# Altium project EE3102_Project.PrjPcb
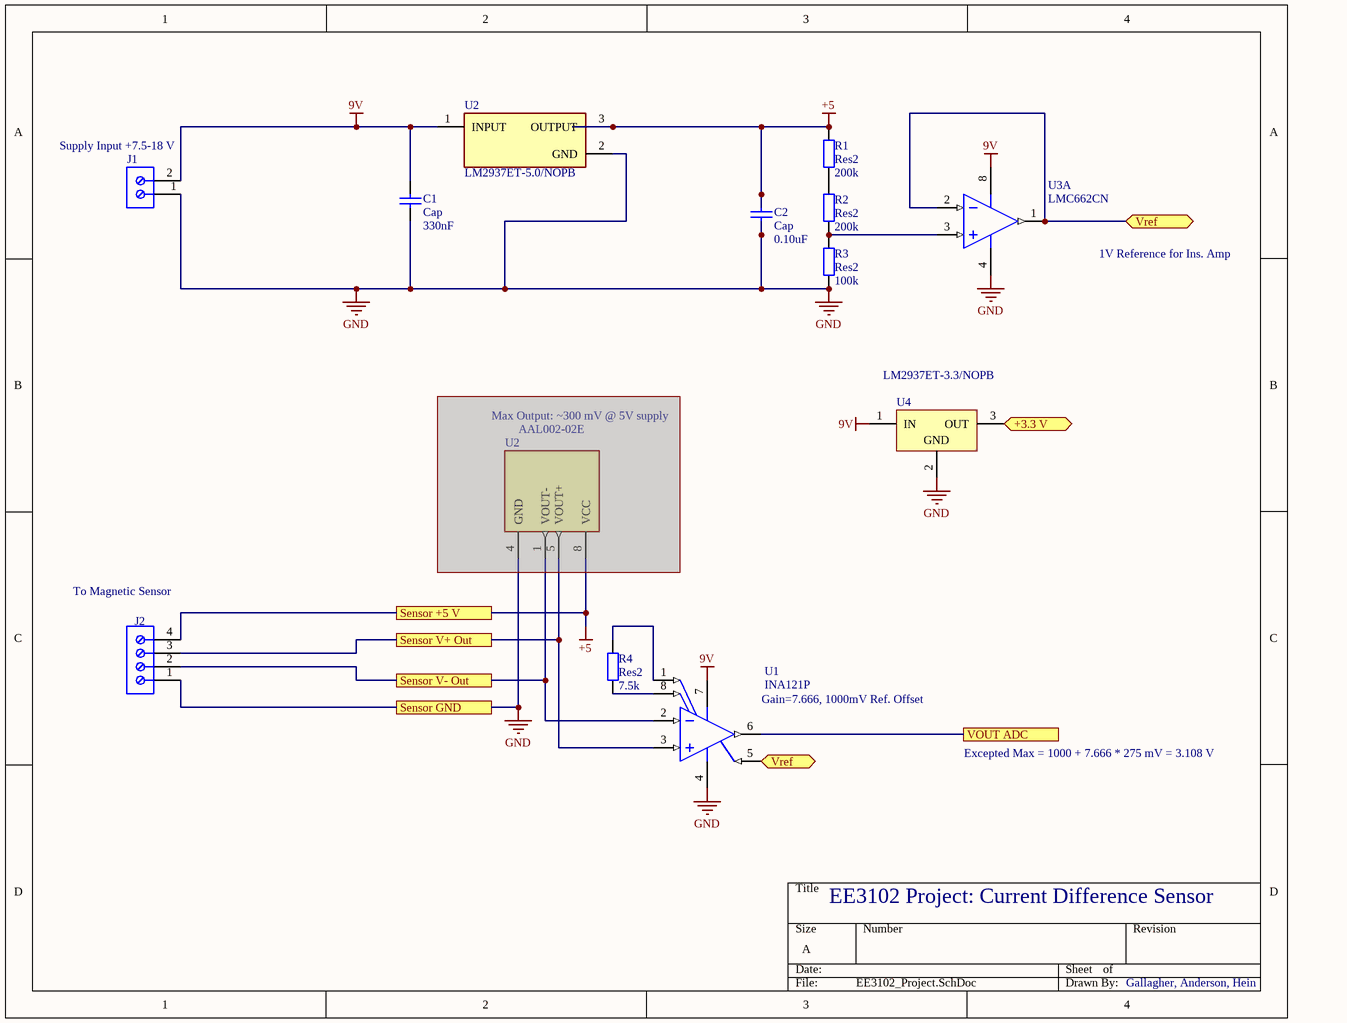
[diagram p0: EE3102_Project.SchDoc]
2 sheets, 21 parts. Net scope: flat (ports and power ports of the same name join across sheets).
Board file: EE3102_Project.PcbDoc
Sheets:
  EE3102_Project.SchDoc
  EE3102_Project_2.SchDoc

## Sheet EE3102_Project.SchDoc
size A; SheetNumber: 1; SheetTotal: 2

### Parts
(Parts that share a designator on the sheet are numbered #1, #2 ... from top to bottom, then left to right.)
C1  Cap  value 330nF  [RAD-0.3]
C2  Cap  value 0.10uF  [RAD-0.3]
J1  691137710002  [691137710002]  (value not drawn)
J2  691210910004  [691210910004]  (value not drawn)
R1  Res2  value 200k  [AXIAL-0.4]
R2  Res2  value 200k  [AXIAL-0.4]
R3  Res2  value 100k  [AXIAL-0.4]
R4  Res2  value 7.5k  [AXIAL-0.4]
U1  INA121P  [P0008A]
U2#1  LM2937ET-5.0/NOPB  [FP-NDE0003B-MFG]
U2#2  AAL002-02E  [Sensor_Socket_8]  (masked out: inside a compile mask, not in the netlist)
U3  LMC662CN  [N08E]  (part A of 2)
U4  LM2937ET-3.3/NOPB  [NDE0003A]

### Ports
+3.3 V (bidir), Sensor +5 V, Sensor GND, Sensor V+ Out, Sensor V- Out, VOUT ADC, Vref (bidir)

### Nets
9V: C1.2 J1.2(GND) U1.7(V+) U2#1.1(INPUT) U3.8(V+) U4.1(IN)
+5: C2.2 J2.4 R1.2 U2#1.3(OUTPUT) ; port Sensor +5 V
GND: C1.1 C2.1 J1.1(+7.5V_-_35V) J2.1 R3.1 U1.4(V-) U2#1.2(GND) U3.4(V-) U4.2(GND) ; port Sensor GND
NetC4_1: U4.3(OUT) ; port +3.3 V
NetJ2_2: J2.2 U1.2(VIN-) ; port Sensor V- Out
NetJ2_3: J2.3 U1.3(VIN+) ; port Sensor V+ Out
NetR1_1: R1.1 R2.2
NetR2_1: R2.1 R3.2 U3.3(INA+)
NetR4_1: R4.1 U1.8(RG)
NetR4_2: R4.2 U1.1(RG)
NetU1_5: U1.5(REF) U3.1(OUTA) U3.2(INA-) ; port Vref
NetU1_6: U1.6(VO) ; port VOUT ADC

### Notes on the sheet
- (near J1) Supply Input +7.5-18 V
- 1V Reference for Ins. Amp
- Max Output: ~300 mV @ 5V supply
- (near J2) To Magnetic Sensor
- (near U1) Gain=7.666, 1000mV Ref. Offset
- Excepted Max = 1000 + 7.666 * 275 mV = 3.108 V
- EE3102 Project: Current Difference Sensor
- Gallagher, Anderson, Hein

### Library data of the parts
C1 C2 = Cap: Capacitor; Published: 8-Jun-2000; LatestRevisionDate: 17-Jul-2002; LatestRevisionNote: Re-released for DXP Platform.; PackageReference: RAD-0.3; Publisher: Altium Limited; PackageDescription: Radial Cap, Thru-Hole; 2 Leads; 0.3 in Pin Spacing
J1 = CMP-1502-03324-1: Series 1377 - 5.00 mm Horizontal Entry with Pressure Clamp WR-TBL, 2 pin; Manufacturer: Wurth Elektronik; Pin Number: 2; Pitch: 5.00mm; Operating Temperature: -30to120degC; Package Reference: 691137710002; Publisher: WurthElektronik; Mounting Technology: THT; Manufacturer URL: http://www.we-online.de; Packaging: Box; Part Number: 691137710002; Datasheet URL: http://katalog.we-online.de/pbs/datasheet/691137710002.pdf
J2 = CMP-1502-02458-1: Serie 2109 - 2.54 mm Horizontal Entry with Rising Cage Clamp WR-TBL, 4 pin; Manufacturer: Wurth Elektronik; Pin Number: 4; Pitch: 2.54mm; Mounting Technology: THT; Datasheet URL: http://katalog.we-online.de/em/datasheet/6912109100xx.pdf; Manufacturer URL: http://www.we-online.de; Operating Temperature: -40to105degC; Publisher: WurthElektronik; Package Reference: 691210910004; Part Number: 691210910004; Packaging: Box
R1-R4 = Res2: Resistor; Published: 8-Jun-2000; LatestRevisionDate: 17-Jul-2002; LatestRevisionNote: Re-released for DXP Platform.; PackageReference: AXIAL-0.4; Publisher: Altium Limited; PackageDescription: Axial Device, Thru-Hole; 2 Leads; 0.4 in Pin Spacing
U1 = CMP-0992-00127-2: FET-Input, Low Power Instrumentation Amplifier, -40 to 85 degC, 8-pin DIP (P8), Green (RoHS & no Sb/Br); Manufacturer: Texas Instruments; Input Bias Current (+/-)(Max)(nA): 0.05; SubFamily: Dual Supply; Input Offset Drift (+/-)(Max)(uV/Degrees Celsius): 5; Input Offset (+/-)(Max)(uV): 500; Quiescent Current (+/-)(Typ)(mA): 0.45; Non-Linearity (+/-)(Max)(%): 0.005; Number of Channels: 1; Noise at 1kHz(Typ)(nV/rt(Hz)): 20; CMRR(Min)(dB): 96; Output Offset Drift (+/-)(Max)(uV/Degrees Celsius): 20/G; Vs(Min)(V): 4.5; Gain(V/V): 1 to 10000; Output Offset (+/-)(Max)(uV): 500/G; Vs(Max)(V): 36; ComponentLink3URL: http://www.ti.com/litv/pdf/mpdi001b; ComponentLink3Description: Package Specification; Mounting Technology: Through Hole; ComponentLink2Description: Datasheet; PackageReference: P0008A; Code_JEDEC: MS-001; Eco-Plan: Green (RoHS & no Sb/Br); ComponentLink1URL: http://www.ti.com/; ComponentLink2URL: http://www.ti.com/general/docs/lit/getliterature.tsp?genericPartNumber=INA121&fileType=pdf; PartNumber: INA121P; ComponentLink1Description: Manufacturer URL; PackageDescription: 8-Pin Plastic In-Line, Body 9.59 x 6.35 mm, Pitch 2.54 mm; DatasheetVersion: SBOS078; PackageVersion: 4040082/E, 04/2010
U2#1 = CMP-0062-02519-4: IC REG LINEAR 5V 500MA TO220-3; Manufacturer: Texas Instruments; Standoff Height: 3.3mm; Max Supply Voltage: 26V; Min Supply Voltage: 6V; Max Junction Temp: +125°C; Number Of Outputs: 1; Accuracy Percentage: 5%; Dropout Voltage: 0.5V; Output Type: Fixed; Nominal Supply Current: 2-10mA; Output Voltage: 5V; Digikey Description: IC REG LINEAR 5V 500MA TO220-3; Temperature: -40°C to +125°C; Category: IC; Temperature Range High: +125°C; ComponentLink2Description: Datasheet; Package: NDE0003B; Manufacturer Part Number: LM2937ET-5.0/NOPB; ComponentLink2URL: http://www.ti.com/lit/ds/symlink/lm2937.pdf; Ipc Land Pattern Name: TO-220; Height: 19.55mm; Device Class L3: Voltage Regulators - Linear; Automotive: No; Octopart: https://octopart.com/lm2937et-5.0%2Fnopb-texas+instruments-24813532; Device Class L1: Integrated Circuits (ICs); Output Current: 500mA; RoHS: TRUE; Temperature Range Low: -40°C; Lead Free: Yes; Device Class L2: Power Management ICs
U2#2 = AAL002-02E: 1.5 mT Sat. Analog Sensor, 5.5 KOhm, RoHS SOIC; MF: NVE; Package: SOIC-8 NVE; SnapEDA_Link: https://www.snapeda.com/parts/AAL002-02E/NVE/view-part/75689/?ref=snap; Value: *; Price: None; MP: AAL002-02E; Availability: Unavailable
U3 = CMP-0055-00172-2: CMOS Dual Operational Amplifier, 8-pin MDIP; Manufacturer: National Semiconductor; PowerWise: N; CompType: Amplifiers; PackageTopMarking: NSUZXYTTE#*LMC*662CN; ComponentLink3Description: N08E Package Page; RoHS: N; ComponentLink3URL: http://www.national.com/packaging/folders/n08e.html; PackageReference: N08E; ComponentLink1URL: http://www.national.com/ds/LM/LMC662.pdf; ComponentLink2Description: LMC662 Web Page; DatasheetVersion: Apr-2003; ComponentLink2URL: http://www.national.com/pf/LM/LMC662.html; PinCount: 8; PackageDescription: MDIP, .365 x .250 x .130in, 8 Lead, .100in Pitch; Code_JEDEC: MS-001-BA; RevisionNote: Component URLs added; ComponentLink1Description: LMC662 Datasheet; PackageVersion: revG, May-2006
U4 = CMP-0062-02520-3: 400mA and 500mA Voltage Regulator, 3-pin TO-220, Pb-Free; Manufacturer: Texas Instruments; CompType: LDO IC; PackageTopMarking: NSUZXYTTE#*LM2937ET*-3.3; PowerWise: N; RoHS: Y; PinCount: 3; PackageDescription: TO-220, Molded, 3 Lead, Straight; ComponentLink1Description: Datasheet URL; ComponentLink1URL: http://www.ti.com/general/docs/lit/getliterature.tsp?genericPartNumber=LM2937-3.3&fileType=pdf; PackageReference: NDE0003A

## Sheet EE3102_Project_2.SchDoc
size A; SheetNumber: 2; SheetTotal: 2
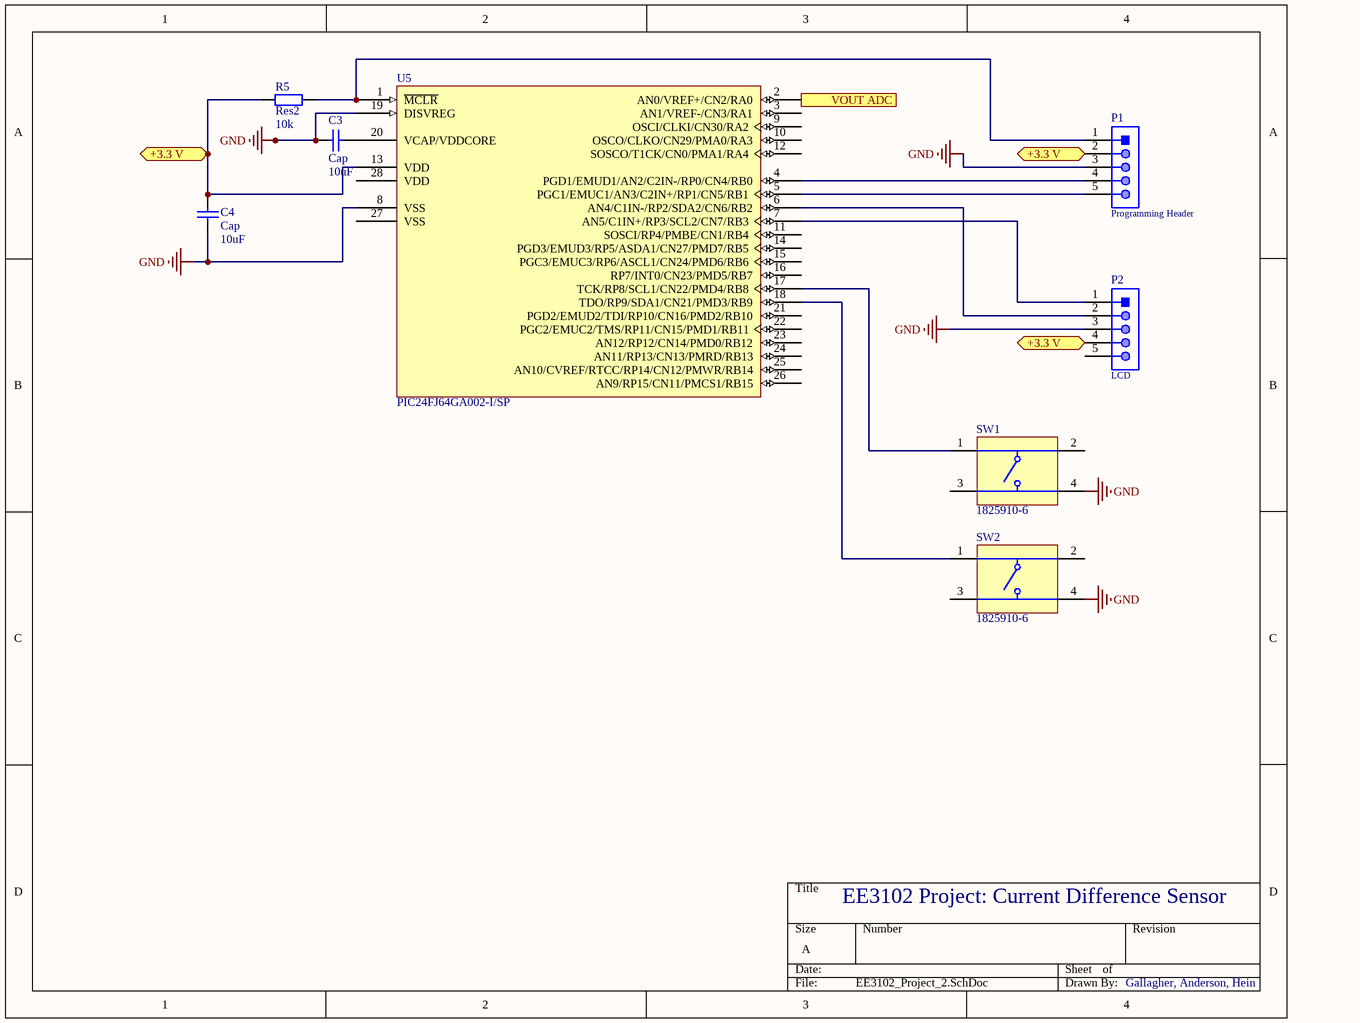
[diagram p1: EE3102_Project_2.SchDoc]

### Parts
C3  Cap  value 10uF  [RAD-0.3]
C4  Cap  value 10uF  [RAD-0.3]
P1  Programming Header  [61300511121]
P2  LCD  [LCD_5_Pin]
R5  Res2  value 10k  [AXIAL-0.4]
SW1  1825910-6  [TECO-1825910-6_V]
SW2  1825910-6  [TECO-1825910-6_V]
U5  PIC24FJ64GA002-I/SP  [SPDIP300-SP28]

### Ports
+3.3 V (bidir), VOUT ADC

### Nets
GND: C3.2 C4.2 P1.3(VSS) P2.3(GND) SW1.4 SW2.4 U5.8(VSS) U5.19(DISVREG)
NetC3_1: C3.1 U5.20(VCAP/VDDCORE)
NetC4_1: C4.1 P1.2(VDD) P2.4(SDA) R5.2 U5.13(VDD) ; port +3.3 V
NetP1_1: P1.1(nmclr) R5.1 U5.1(~{MCLR})
NetP1_4: P1.4(PGD) U5.4(PGD1/EMUD1/AN2/C2IN-/RP0/CN4/RB0)
NetP1_5: P1.5(PGC) U5.5(PGC1/EMUC1/AN3/C2IN+/RP1/CN5/RB1)
NetP2_1: P2.1(XRST) U5.7(AN5/C1IN+/RP3/SCL2/CN7/RB3)
NetP2_2: P2.2(VDD) U5.6(AN4/C1IN-/RP2/SDA2/CN6/RB2)
NetSW1_1: SW1.1 U5.17(TCK/RP8/SCL1/CN22/PMD4/RB8)
NetSW2_1: SW2.1 U5.18(TDO/RP9/SDA1/CN21/PMD3/RB9)
NetU1_6: U5.2(AN0/VREF+/CN2/RA0) ; port VOUT ADC

Not connected (* = marked no-connect by the designer): P2 5(SCL); SW1 2 3; SW2 2 3; U5 3(AN1/VREF-/CN3/RA1) 9(OSCI/CLKI/CN30/RA2) 10(OSCO/CLKO/CN29/PMA0/RA3) 11(SOSCI/RP4/PMBE/CN1/RB4) 12(SOSCO/T1CK/CN0/PMA1/RA4) 14(PGD3/EMUD3/RP5/ASDA1/CN27/PMD7/RB5) 15(PGC3/EMUC3/RP6/ASCL1/CN24/PMD6/RB6) 16(RP7/INT0/CN23/PMD5/RB7) 21(PGD2/EMUD2/TDI/RP10/CN16/PMD2/RB10) 22(PGC2/EMUC2/TMS/RP11/CN15/PMD1/RB11) 23(AN12/RP12/CN14/PMD0/RB12) 24(AN11/RP13/CN13/PMRD/RB13) 25(AN10/CVREF/RTCC/RP14/CN12/PMWR/RB14) 26(AN9/RP15/CN11/PMCS1/RB15) 27(VSS) 28(VDD)

### Notes on the sheet
- EE3102 Project: Current Difference Sensor
- Gallagher, Anderson, Hein

### Library data of the parts
C3 C4 = Cap: Capacitor; Published: 8-Jun-2000; LatestRevisionDate: 17-Jul-2002; LatestRevisionNote: Re-released for DXP Platform.; PackageReference: RAD-0.3; Publisher: Altium Limited; PackageDescription: Radial Cap, Thru-Hole; 2 Leads; 0.3 in Pin Spacing
P1 = CMP-1502-01068-1: THT Vertical Pin Header WR-PHD, Pitch 2.54 mm, Single Row, 5 pins; Manufacturer: Wurth Elektronik; Pin Number: 5; Contact Resistance: 20mOhm; Working Voltage: 250VAC; Pitch: 2.54mm; Withstanding Voltage: 500VAC; Rated Current: 3A; Gender: Male; Datasheet URL: https://katalog.we-online.de/em/datasheet/6130xx11121.pdf; Orientation: Vertical; Mounting Technology: THT; Row Number: Single; Package Reference: 61300511121; Publisher: WurthElektronik; Part Number: 61300511121; Packaging: Bag; Manufacturer URL: http://www.we-online.de; Operating Temperature: -40to105degC
P2 = WE-CN-1P-M-R5: THT Vertical Pin Header WR-PHD, Pitch 2.54 mm, Single Row, 5 pins; Part Number: 61300511121; Manufacturer: Wurth Elektronik; Pin Number: 5; Contact Resistance: 20mOhm; Working Voltage: 250VAC; Pitch: 2.54mm; Withstanding Voltage: 500VAC; Rated Current: 3A; Gender: Male; Datasheet URL: https://katalog.we-online.de/em/datasheet/6130xx11121.pdf; Orientation: Vertical; Mounting Technology: THT; Row Number: Single; Package Reference: 61300511121; Publisher: WurthElektronik; Packaging: Bag; Manufacturer URL: http://www.we-online.de; Operating Temperature: -40to105degC
R5 = Res2: Resistor; Published: 8-Jun-2000; LatestRevisionDate: 17-Jul-2002; LatestRevisionNote: Re-released for DXP Platform.; PackageReference: AXIAL-0.4; Publisher: Altium Limited; PackageDescription: Axial Device, Thru-Hole; 2 Leads; 0.4 in Pin Spacing
SW1 SW2 = CMP-1684-00021-1: Tact Switch, SPST-NO, 0.05 A, -35 to 85 degC, 4-Pin THD, RoHS, Bulk; Manufacturer: TE Connectivity; Maximum Contact Resistance: 100mOhm; Mechanical Life: 100000Cycles; Bushing Type: Unthreaded; Switch Configuration: OFF(ON); Maximum DC Voltage Rating: 24V; Contact Rating @ Voltage: 0.05A@24VDC; Actuator Color: Black; Body Orientation: Straight; Function: MomentaryContact; Illumination: N/R; Actuator Style: RoundButton; Actuator Material: PolybutyleneTerephthalate; Dielectric Strength: 500VAC; Pole Throw Configuration: SPST; Actuator Length: 1.4mm; Product Weight: N/A; Contact Material: CopperAlloy; Housing Material: N/A; Terminal Type: PCPins; Minimum Insulation Resistance: 100MOhm; Package Description: 4-Pin Through Hole Device, Body 5.99 x 5.99 mm, Pitch 6.5 mm; Part No: 1825910-6; Package Reference: THD; Base Material: N/A; Manufacturer URL: http://www.te.com; Contact Plating: Silver; RoHS: Yes; Datasheet Version: Rev. C9; Electrical Life: 100000Cycles; Maximum AC Voltage Rating: N/A; Thread Size: N/R; Operating Temperature: -35to85C; Mounting: ThroughHole; Dimension: 5.99x5mm; Datasheet URL: http://www.te.com/commerce/DocumentDelivery/DDEController?Action=showdoc&DocId=Customer+Drawing%7F1825910%7FC9%7Fpdf%7FEnglish%7FENG_CD_1825910_C9.pdf%7F1825910-6; Family: 1825910; Seal Location: N/A; Seal Description: N/A; Packaging: N/A
U5 = CMP-0046-00003-2: General Purpose 16-Bit Flash Microcontroller, 64KB Flash, 8KB SRAM, 28-Pin SPDIP, Industrial Temperature; RevisionNote: Component URLs added.; ComponentLink2URL: http://www.microchip.com/stellent/groups/techpub_sg/documents/packagingspec/en012702.pdf; ComponentLink2Description: Packaging Specification; PackageDescription: 28-Lead Skinny Plastic Dual In-Line (SP) - 300 mil Body [SPDIP]; PackageReference: SPDIP300-SP28; DatasheetVersion: revD, Feb-2010; PackageVersion: revBB, Aug-2009; ComponentLink3Description: Microchip.com Home; ComponentLink3URL: http://www.microchip.com/; ComponentLink1Description: Datasheet; ComponentLink1URL: http://ww1.microchip.com/downloads/en/DeviceDoc/39881D.pdf

## Nets that join several sheets
GND: EE3102_Project (9 pins), EE3102_Project_2 (8 pins)
NetC4_1: EE3102_Project (U4.3), EE3102_Project_2 (5 pins)
NetU1_6: EE3102_Project (U1.6), EE3102_Project_2 (U5.2)